# EAGLE schematic NightLightWiring (EAGLE 7.6.0)
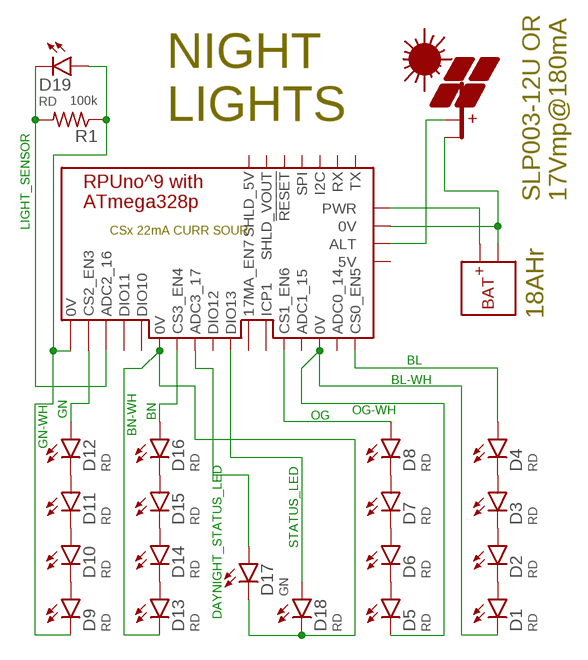
[diagram p0: schematic, sheet 1]

## Parts
BM3  RPUNO  [NA-30]
D1  RD  LED5MM  [LED5MM]
D2  RD  LED5MM  [LED5MM]
D3  RD  LED5MM  [LED5MM]
D4  RD  LED5MM  [LED5MM]
D5  RD  LED5MM  [LED5MM]
D6  RD  LED5MM  [LED5MM]
D7  RD  LED5MM  [LED5MM]
D8  RD  LED5MM  [LED5MM]
D9  RD  LED5MM  [LED5MM]
D10  RD  LED5MM  [LED5MM]
D11  RD  LED5MM  [LED5MM]
D12  RD  LED5MM  [LED5MM]
D13  RD  LED5MM  [LED5MM]
D14  RD  LED5MM  [LED5MM]
D15  RD  LED5MM  [LED5MM]
D16  RD  LED5MM  [LED5MM]
D17  GN  LED5MM  [LED5MM]
D18  RD  LED5MM  [LED5MM]
D19  RD  LED5MM  [LED5MM]
PV4  PV  [NA-30]
R1  100k  R0805  [C0805(2012)]
U$7  BAT  [NA-30]

## Nets
0V: D17.K D18.K
BL: BM3.23(CS0_EN5) D4.A
BL-WH: BM3.26(0V) D1.K
BN: BM3.29(CS3_EN4) D16.A
BN-WH: BM3.28(0V) D13.K
DAYNIGHT_STATUS_LED: BM3.16(ADC3_17) D17.A
GN: BM3.24(CS2_EN3) D12.A
GN-WH: BM3.27(0V) D9.K D19.A R1.1
LIGHT_SENSOR: BM3.13(ADC2_16) D19.K R1.2
N$1: U$7.1(+BAT)
N$4: D2.A D3.K
N$5: D3.A D4.K
N$6: D1.A D2.K
N$9: D5.A D6.K
N$10: D6.A D7.K
N$11: D7.A D8.K
N$14: D9.A D10.K
N$15: D10.A D11.K
N$16: D11.A D12.K
N$18: D13.A D14.K
N$19: D14.A D15.K
N$20: D15.A D16.K
N$42: PV4.2(-PV) U$7.2(-BAT)
N$50: PV4.1(+PV)
OG: BM3.22(CS1_EN6) D8.A
OG-WH: D5.K
STATUS_LED: BM3.18(DIO13) D18.A
Unconnected: BM3.1(TX) BM3.2(RX) BM3.3(I2C) BM3.4(SPI) BM3.5(!RESET) BM3.6(SHLD_5V) BM3.7(SHLD_VOUT) BM3.8(PWR) BM3.9(0V) BM3.10(ADC1_15) BM3.11(ADC0_14) BM3.12(ICP1) BM3.14(DIO11) BM3.15(DIO10) BM3.17(DIO12) BM3.19(5V) BM3.20(ALT) BM3.21(17MA_EN7)

## Notes on the sheet
- NIGHT 
  LIGHTS
- SLP003-12U OR
  17Vmp@180mA
- 18AHr

## Library data of the parts
BM3 = Documentation:RPUNO: BM /w 328p
D1-D19 = D-LED:LED: LED 120120WH [CREE,XHGAWT-00-0000-00000HXE1] LED WHITE 6500K 150LUM-W120120
PV4 = Documentation:PV
R1 = R-C:R: Resiistor American-style symbol
U$7 = Documentation:BAT